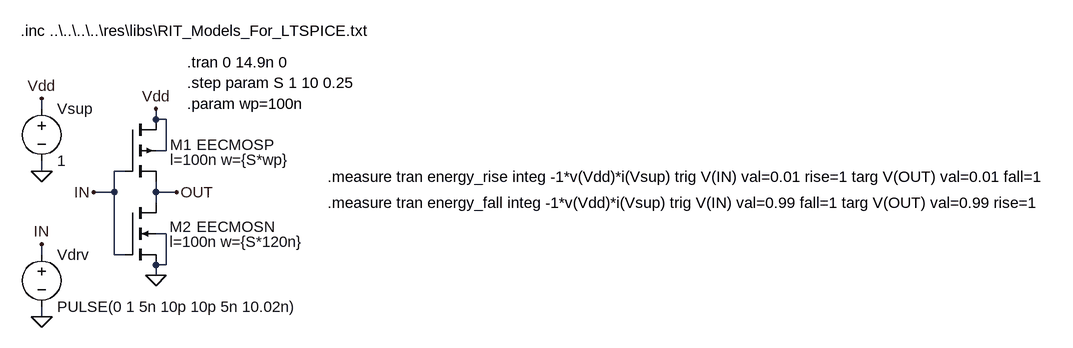
[diagram p0: schematic inverter_Cd.asc]
inverter_Cd.asc, the LTspice schematic file:
Version 4
SHEET 1 2056 680
WIRE 16 48 16 32
WIRE 192 64 192 48
WIRE 208 64 192 64
WIRE 208 112 208 64
WIRE 208 112 192 112
WIRE 16 144 16 128
WIRE 144 144 128 144
WIRE 128 176 128 144
WIRE 128 176 96 176
WIRE 192 176 192 160
WIRE 224 176 192 176
WIRE 192 192 192 176
WIRE 208 240 192 240
WIRE 16 272 16 256
WIRE 128 272 128 176
WIRE 144 272 128 272
WIRE 208 288 208 240
WIRE 208 288 192 288
WIRE 192 304 192 288
WIRE 16 368 16 352
FLAG 192 304 0
FLAG 192 48 Vdd
FLAG 96 176 IN
FLAG 224 176 OUT
FLAG 16 256 IN
FLAG 16 32 Vdd
FLAG 16 368 0
FLAG 16 144 0
SYMBOL voltage 16 32 R0
WINDOW 123 0 0 Left 0
WINDOW 39 0 0 Left 0
SYMATTR InstName Vsup
SYMATTR Value 1
SYMBOL voltage 16 256 R0
WINDOW 123 0 0 Left 0
WINDOW 39 0 0 Left 0
SYMATTR InstName Vdrv
SYMATTR Value PULSE(0 1 5n 10p 10p 5n 10.02n)
SYMBOL pmos4 144 64 R0
WINDOW 0 70 39 Left 2
WINDOW 3 111 39 Left 2
WINDOW 123 70 62 Left 2
SYMATTR InstName M1
SYMATTR Value EECMOSP
SYMATTR Value2 l=100n w={S*wp}
SYMBOL nmos4 144 192 R0
WINDOW 0 69 37 Left 2
WINDOW 3 111 37 Left 2
WINDOW 123 69 60 Left 2
SYMATTR InstName M2
SYMATTR Value EECMOSN
SYMATTR Value2 l=100n w={S*120n}
TEXT -16 -72 Left 2 !.inc ..\\..\\..\\..\\res\\libs\\RIT_Models_For_LTSPICE.txt
TEXT 240 -24 Left 2 !.tran 0 14.9n 0
TEXT 240 8 Left 2 !.step param S 1 10 0.25
TEXT 240 40 Left 2 !.param wp=100n
TEXT 456 152 Left 2 !.measure tran energy_rise integ -1*v(Vdd)*i(Vsup) trig V(IN) val=0.01 rise=1 targ V(OUT) val=0.01 fall=1
TEXT 456 192 Left 2 !.measure tran energy_fall integ -1*v(Vdd)*i(Vsup) trig V(IN) val=0.99 fall=1 targ V(OUT) val=0.99 rise=1

The netlist it stands for:
* inverter_Cd.asc
Vsup Vdd 0 1
Vdrv IN 0 PULSE(0 1 5n 10p 10p 5n 10.02n)
M1 Vdd IN OUT Vdd EECMOSP l=100n w={S*wp}
M2 OUT IN 0 0 EECMOSN l=100n w={S*120n}
.model NMOS NMOS
.model PMOS PMOS
.lib standard.mos
.inc ..\..\..\..\res\libs\RIT_Models_For_LTSPICE.txt
.tran 0 14.9n 0
.step param S 1 10 0.25
.param wp=100n
.measure tran energy_rise integ -1*v(Vdd)*i(Vsup) trig V(IN) val=0.01 rise=1 targ V(OUT) val=0.01 fall=1
.measure tran energy_fall integ -1*v(Vdd)*i(Vsup) trig V(IN) val=0.99 fall=1 targ V(OUT) val=0.99 rise=1
.backanno
.end